# Altium schematic sheet HVGA.SchDoc
size A4
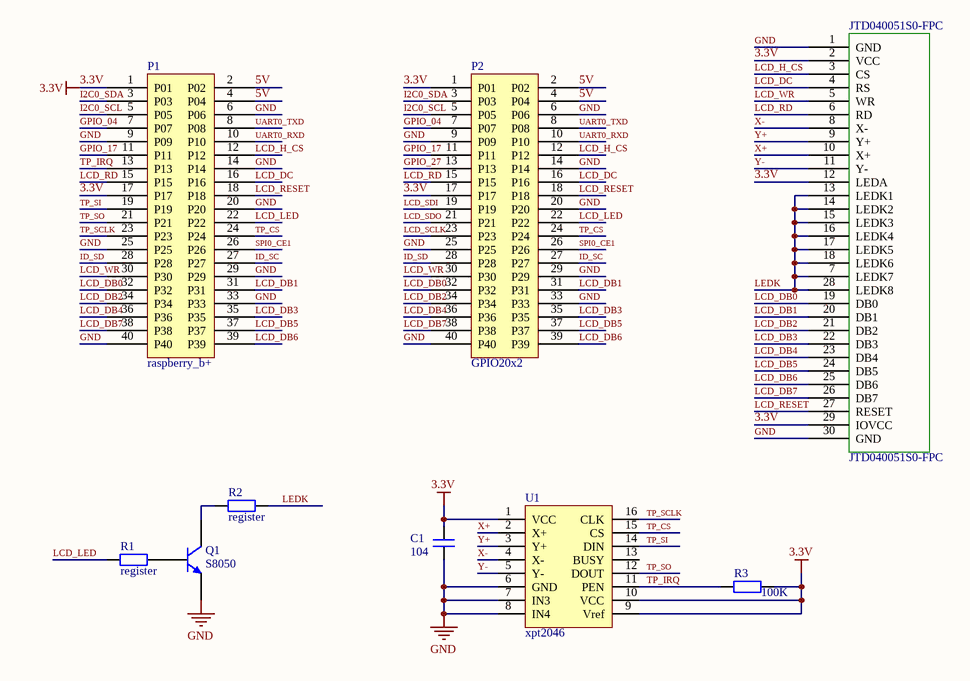
[diagram p0: HVGA.SchDoc]

## Parts
C1  104  [1206]
JTD040051S0-FPC  JTD040051S0-FPC  [JTD040051S0-FPC]
P1  raspberry_b+  [GPIO20x2]
P2  GPIO20x2  [GPIO20x2]
Q1  S8050  [SOT23]
R1  register  [1206]
R2  register  [1206]
R3  100K  [1206]
U1  xpt2046  [TSSOP16]

## Nets
3.3V: C1.2 JTD040051S0-FPC.2(VCC) JTD040051S0-FPC.12(LEDA) JTD040051S0-FPC.29(IOVCC) P1.1(P01) P1.17(P17) P2.1(P01) P2.17(P17) R3.2 U1.1(VCC) U1.9(Vref) U1.10(VCC)
GND: C1.1 JTD040051S0-FPC.1(GND) JTD040051S0-FPC.30(GND) P1.6(P06) P1.9(P09) P1.14(P14) P1.20(P20) P1.25(P25) P1.29(P29) P1.33(P33) P1.40(P40) P2.6(P06) P2.9(P09) P2.14(P14) P2.20(P20) P2.25(P25) P2.29(P29) P2.33(P33) P2.40(P40) Q1.1(E) U1.6(GND) U1.7(IN3) U1.8(IN4)
5V: P1.2(P02) P1.4(P04) P2.2(P02) P2.4(P04)
GPIO_04: P1.7(P07) P2.7(P07)
GPIO_17: P1.11(P11) P2.11(P11)
GPIO_27: P2.13(P13)
I2C0_SCL: P1.5(P05) P2.5(P05)
I2C0_SDA: P1.3(P03) P2.3(P03)
ID_SC: P1.27(P27) P2.27(P27)
ID_SD: P1.28(P28) P2.28(P28)
LCD_DB0: JTD040051S0-FPC.19(DB0) P1.32(P32) P2.32(P32)
LCD_DB1: JTD040051S0-FPC.20(DB1) P1.31(P31) P2.31(P31)
LCD_DB2: JTD040051S0-FPC.21(DB2) P1.34(P34) P2.34(P34)
LCD_DB3: JTD040051S0-FPC.22(DB3) P1.35(P35) P2.35(P35)
LCD_DB4: JTD040051S0-FPC.23(DB4) P1.36(P36) P2.36(P36)
LCD_DB5: JTD040051S0-FPC.24(DB5) P1.37(P37) P2.37(P37)
LCD_DB6: JTD040051S0-FPC.25(DB6) P1.39(P39) P2.39(P39)
LCD_DB7: JTD040051S0-FPC.26(DB7) P1.38(P38) P2.38(P38)
LCD_DC: JTD040051S0-FPC.4(RS) P1.16(P16) P2.16(P16)
LCD_H_CS: JTD040051S0-FPC.3(CS) P1.12(P12) P2.12(P12)
LCD_LED: P1.22(P22) P2.22(P22) R1.1
LCD_RD: JTD040051S0-FPC.6(RD) P1.15(P15) P2.15(P15)
LCD_RESET: JTD040051S0-FPC.27(RESET) P1.18(P18) P2.18(P18)
LCD_SCLK: P2.23(P23)
LCD_SDI: P2.19(P19)
LCD_SDO: P2.21(P21)
LCD_WR: JTD040051S0-FPC.5(WR) P1.30(P30) P2.30(P30)
LEDK: JTD040051S0-FPC.7(LEDK7) JTD040051S0-FPC.13(LEDK1) JTD040051S0-FPC.14(LEDK2) JTD040051S0-FPC.15(LEDK3) JTD040051S0-FPC.16(LEDK4) JTD040051S0-FPC.17(LEDK5) JTD040051S0-FPC.18(LEDK6) JTD040051S0-FPC.28(LEDK8) R2.2
SPI0_CE1: P1.26(P26) P2.26(P26)
TP_CS: P1.24(P24) P2.24(P24) U1.15(CS)
TP_IRQ: P1.13(P13) R3.1 U1.11(PEN)
TP_SCLK: P1.23(P23) U1.16(CLK)
TP_SI: P1.19(P19) U1.14(DIN)
TP_SO: P1.21(P21) U1.12(DOUT)
UART0_RXD: P1.10(P10) P2.10(P10)
UART0_TXD: P1.8(P08) P2.8(P08)
X+: JTD040051S0-FPC.10(X+) U1.2(X+)
X-: JTD040051S0-FPC.8(X-) U1.4(X-)
Y+: JTD040051S0-FPC.9(Y+) U1.3(Y+)
Y-: JTD040051S0-FPC.11(Y-) U1.5(Y-)
NetQ1_2: Q1.2(B) R1.2
NetQ1_3: Q1.3(C) R2.1

Not connected (* = marked no-connect by the designer): U1 13(BUSY)

## Library data of the parts
C1 = capacitor
P2 = raspberry_b+
R3 = register